# EasyEDA Pro project ProPrj_FireWheels_2025-05-12.epro, schematic Schematic2
Board Name: RC PAD; Create Date: 2025-05-06; Page Name: P1; Project Name: FireWheels; Schematic Name: Schematic2; Update Date: 2025-05-06; Company: EasyEDA.com; Page Size: A4; Version: V1.0
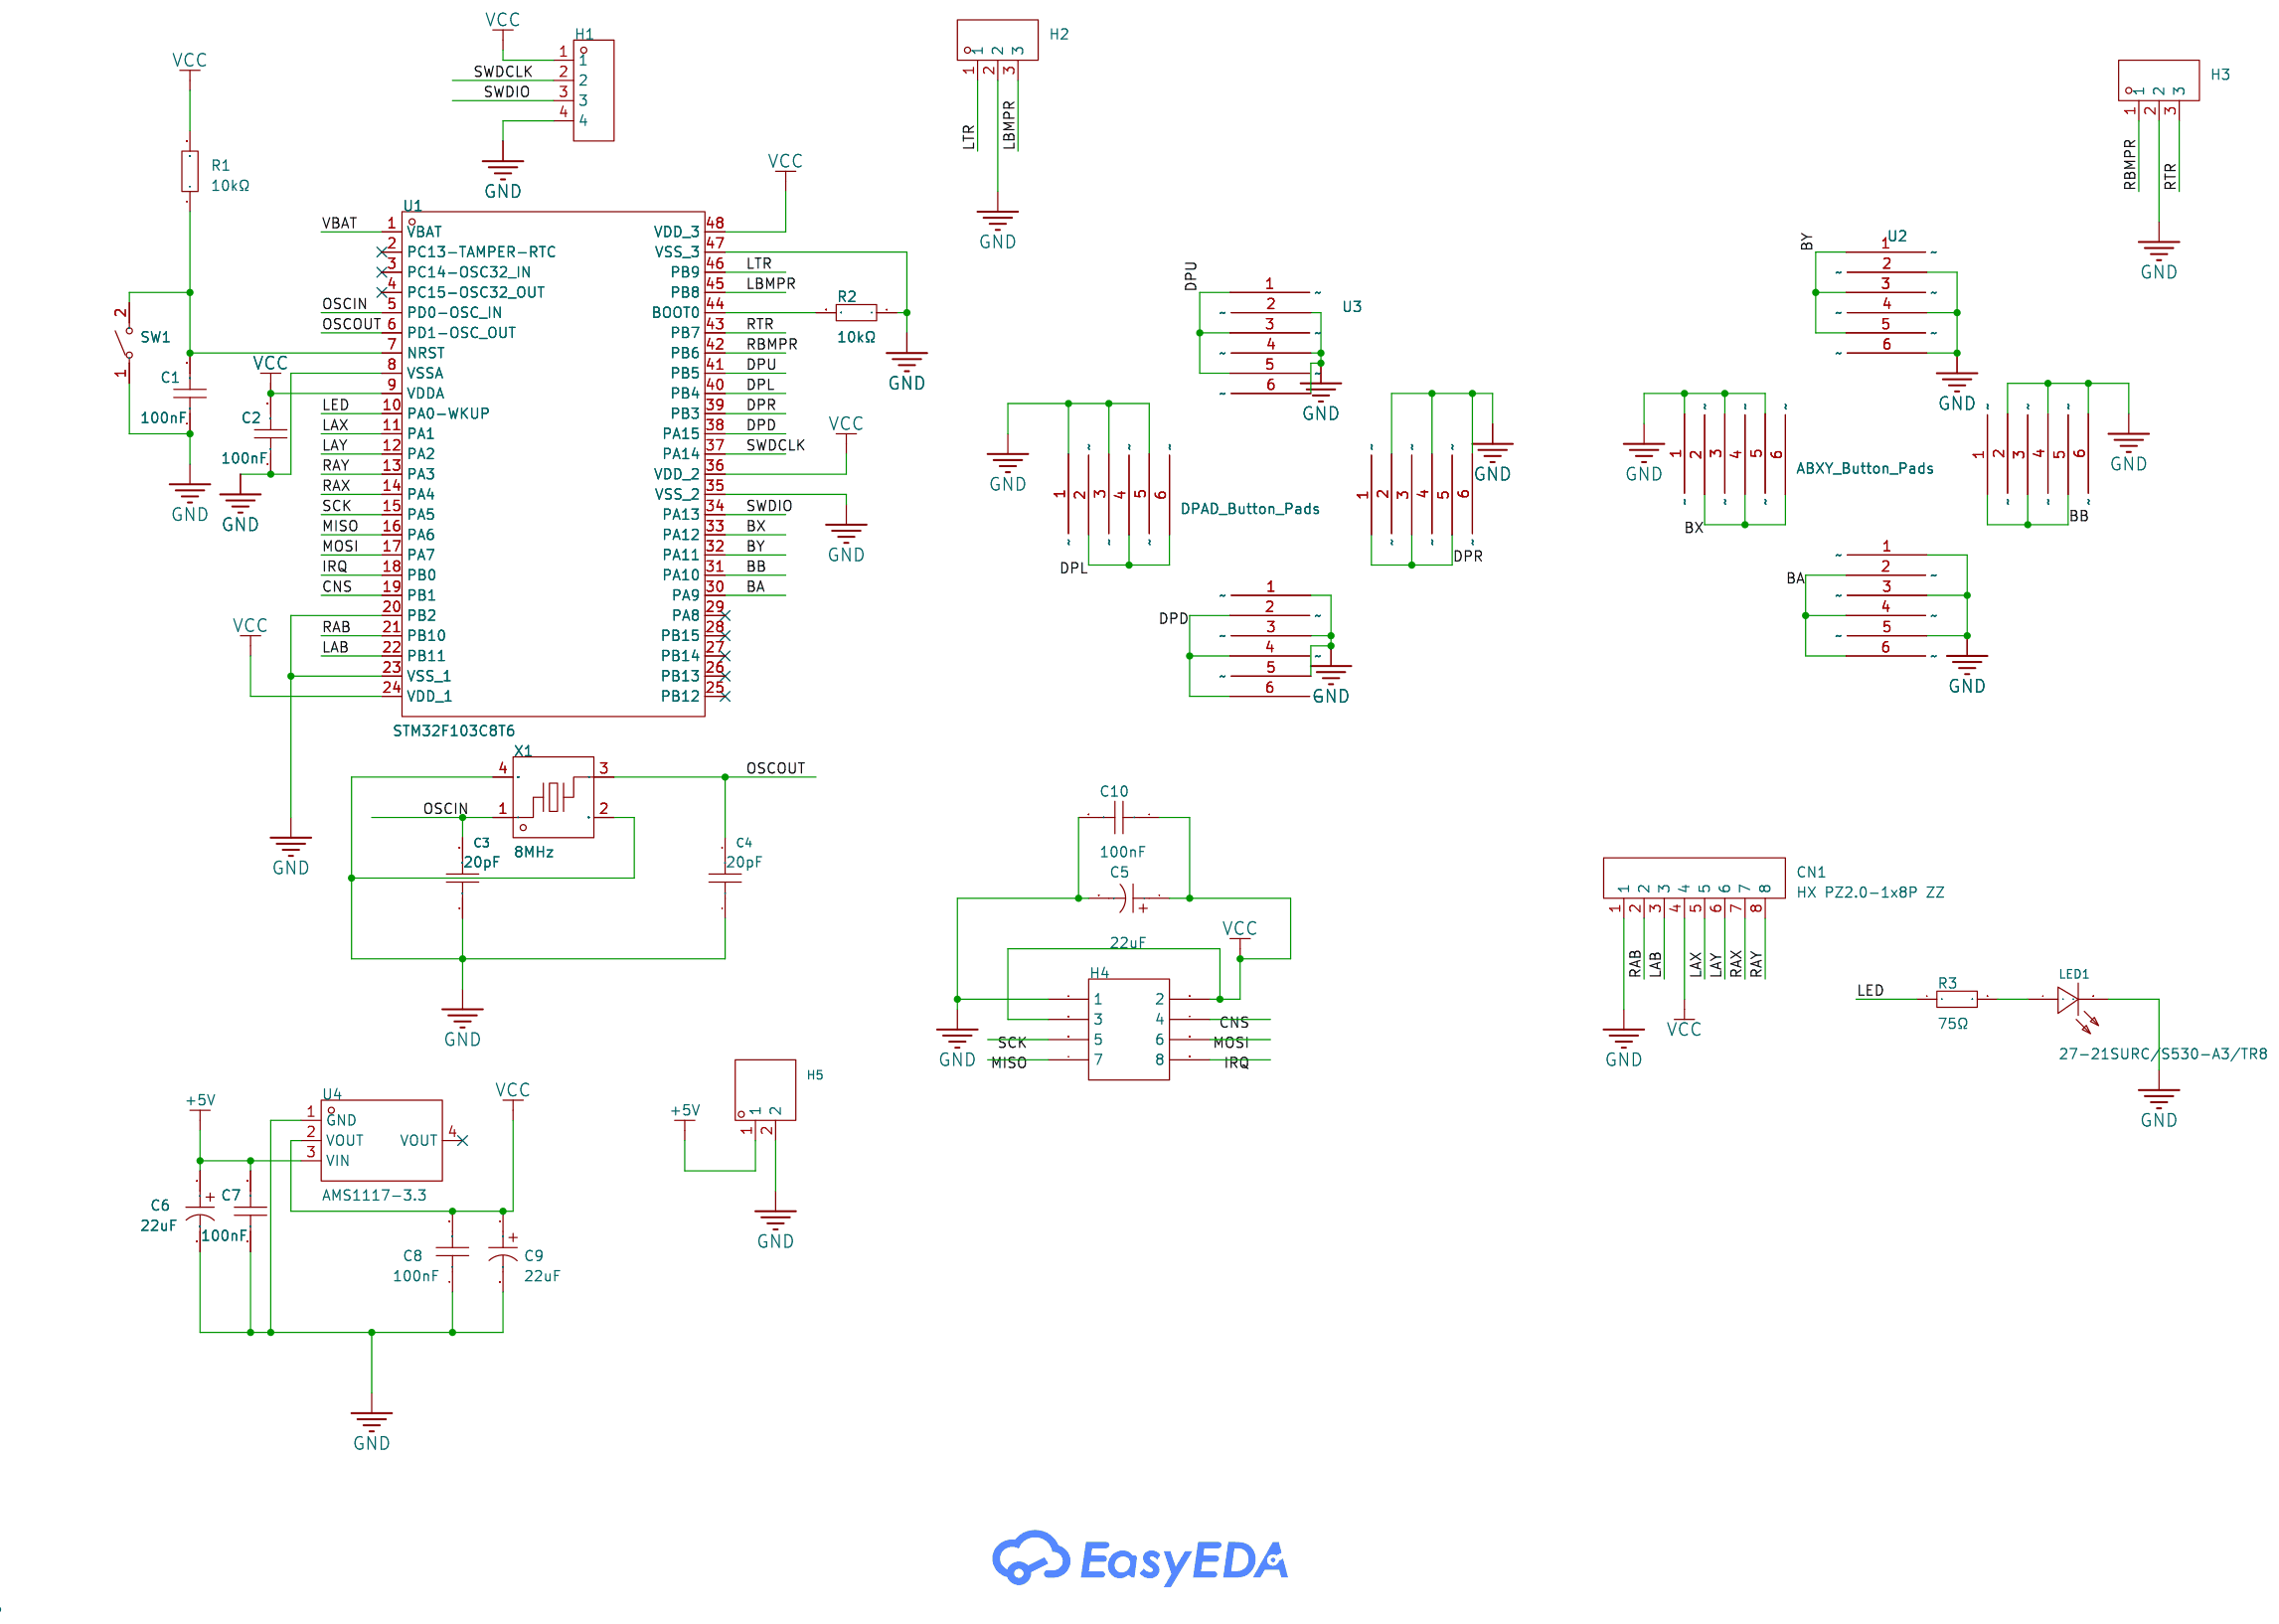
[diagram p2: schematic sheet]

## Parts
C1  100nF  [C0805]
C2  100nF  [C0805]
C3  20pF  [C0603]
C4  20pF  [C0603]
C5  22uF  [CAP-SMD_L3.5-W2.8-FD]
C6  22uF  [CAP-SMD_L3.5-W2.8-FD]
C7  100nF  [C0805]
C8  100nF  [C0805]
C9  22uF  [CAP-SMD_L3.5-W2.8-FD]
C10  100nF  [C0805]
CN1  HX PZ2.0-1x8P ZZ  [HDR-TH_8P-P2.00-V-M]
H1  -  [HDR-TH_4P-P2.54-V-M]
H2  -  [HDR-TH_3P-P2.54-V-M]
H3  -  [HDR-TH_3P-P2.54-V-M]
H4  -  [HDR-TH_8P-P2.54-V-F-R2-C4-S2.54-1]
H5  -  [HDR-TH_2P-P2.54-V-M-1]
LED1  27-21SURC/S530-A3/TR8  [LED-SMD_L1.7-W1.1-R-RD_RED]
R1  10kΩ  [R0603]
R2  10kΩ  [R0603]
R3  75Ω  [R1206]
SW1  -  [SW-SMD_L3.9-W3.0-P4.45]
U1  STM32F103C8T6  [LQFP-48_L7.0-W7.0-P0.50-LS9.0-BL]
U2  ABXY_Button_Pads  [ABXY_Button_Pads_MOD]
U3  DPAD_Button_Pads  [DPAD_Button_Pads_MOD]
U4  AMS1117-3.3  [SOT-223-3_L6.7-W3.7-P2.30-LS7.0-BR]
X1  8MHz  [CRYSTAL-SMD_4P-L3.2-W2.5-BL]

## Library data of the parts
C1 C2 C7 C8 C10 = 0805B104K250NT: Capacitance:100nF Tolerance:±10% Tolerance:±10% Voltage Rating: Temperature Coefficient:; LCSC Part Name: 100nF ±10% 25V; Supplier Part: C5120075; Manufacturer: FH(风华); Supplier Footprint: 0805; JLCPCB Part Class: Extended Part; Datasheet: https://atta.szlcsc.com/upload/public/pdf/source/20220722/AC92D000C7DDA6224FF67F7486E69D7A.pdf; Supplier: LCSC; Tolerance: ±10%
C3 C4 = TCC0603COG200J500CT: Capacitance: Tolerance:±5% Tolerance:±5% Voltage Rated: Temperature Coefficient:; LCSC Part Name: 20pF ±5% 50V; Supplier Part: C376774; Manufacturer: CCTC(三环); Supplier Footprint: 0603; JLCPCB Part Class: Extended Part; Datasheet: https://atta.szlcsc.com/upload/public/pdf/source/20191203/C466239_F62A586702D44EEA1C39B32FC8662B21.pdf; Supplier: LCSC; Tolerance: ±5%
C5 C6 C9 = T491B226K004AT: Capacitance: Tolerance:±10% Tolerance:±10% Voltage Rating: Current - Leakage:- Ripple Current:- Equivalent Series Resistance(ESR):3.5Ω Operating Temperature:-55℃~+125℃ Operating Temperature:-55℃~+125℃; LCSC Part Name: 22uF ±10% 4V; Supplier Part: C1953267; Manufacturer: KEMET(基美); Supplier Footprint: 1411; JLCPCB Part Class: Extended Part; Datasheet: https://atta.szlcsc.com/upload/public/pdf/source/20210416/95C0EC5B3581C9A90529545117ABEAC1.pdf; Supplier: LCSC; Tolerance: ±10%; Equivalent Series Resistance(ESR): 3.5Ω; Operating Temperature: -55℃~+125℃
CN1 = HX PZ2.0-1x8P ZZ: Pin Structure:1x8P Pitch:2mm Row Spacing:- Circluar Pins/Square Pins:Policy Mounting Type:Straight Number of Rows:Single Row Number of Pins:8P Current Rating:1.5A Voltage Rating (Max):- Length of Mating Pin:3.9mm Insulation Height:2mm Length of End Connec; LCSC Part Name: 1x8P 间距:2mm 方针 直插; Supplier Part: C22438291; Manufacturer: hanxia(韩下); Supplier Footprint: 插件,P=2mm; JLCPCB Part Class: Extended Part; Datasheet: https://atta.szlcsc.com/upload/public/pdf/source/20240522/C8C63A86F235927351453C32C5550B55.pdf; Supplier: LCSC; Pin Structure: 1x8P; Pitch: 2mm; Circluar Pins/Square Pins: Policy; Mounting Type: Straight; Number of Rows: Single Row; Number of Pins: 8P; Current Rating: 1.5A; Length of Mating Pin: 3.9mm; Insulation Height: 2mm; Length of End Connection Pin: 2.8mm; Contact Material: Phosphor Bronze; Contact Plating: Gold; Operating Temperature: -40℃~+105℃; Color: Black
H1 = HDR-M_2.54_1x4P: Supplier Footprint: Through
H2 H3 = HDR-M_2.54_1x3P: Supplier Footprint: Through
H4 = HDR-F-2.54_2x4: Supplier Footprint: Through
H5 = HDR-M_2.54_1x2P: Supplier Footprint: Through
LED1 = 27-21SURC/S530-A3/TR8: Emitted Color:Red Forward Voltage (VF):2V Forward Voltage (VF):2V Forward Current:20mA Dominant Wavelength:624nm Dominant Wavelength:624nm Peak Wavelength:632nm Lens Color:无色透明透镜 Luminous Intensity:57mcd Luminous Intensity:57mcd Viewing Angle:130°; LCSC Part Name: 红灯; Supplier Part: C131210; Manufacturer: EVERLIGHT(亿光); Supplier Footprint: SMD,1.1x1.7mm; JLCPCB Part Class: Extended Part; Datasheet: https://atta.szlcsc.com/upload/public/pdf/source/20170918/C131210_1505726868415976222.pdf; Supplier: LCSC; Emitted Color: Red; Forward Voltage (VF): 2V; Forward Current: 20mA; Dominant Wavelength: 624nm; Peak Wavelength: 632nm; Lens Color: 无色透明透镜; Luminous Intensity: 57mcd; Viewing Angle: 130°
R1 R2 = RC0603FR-0710KL: Type:Thick Film Resistors Resistance: Tolerance:±1% Tolerance:±1% Power(Watts): Overload Voltage (Max): Temperature Coefficient:±100ppm/℃ Temperature Coefficient:±100ppm/℃ Operating Temperature Range:-55℃~+155℃ Operating Temperature Range:-55℃~+155℃; LCSC Part Name: 厚膜电阻 10kΩ ±1% 100mW; Supplier Part: C98220; Manufacturer: YAGEO(国巨); Supplier Footprint: 0603; JLCPCB Part Class: Extended Part; Datasheet: https://atta.szlcsc.com/upload/public/pdf/source/20180927/C295883_E8D83085EA81BD7DE0B2B681138C15EE.pdf; Supplier: LCSC; Type: Thick Film Resistors; Tolerance: ±1%; Temperature Coefficient: ±100ppm/℃; Operating Temperature Range: -55℃~+155℃
R3 = RC1206FR-0775RL: Type:Thick Film Resistors Resistance: Tolerance:±1% Tolerance:±1% Power(Watts):250mW Overload Voltage (Max): Temperature Coefficient:±100ppm/℃ Temperature Coefficient:±100ppm/℃ Operating Temperature Range:-55℃~+155℃ Operating Temperature Range:-55℃~+155℃; LCSC Part Name: 厚膜电阻 75Ω ±1% 250mW; Supplier Part: C137233; Manufacturer: YAGEO(国巨); Supplier Footprint: 1206; JLCPCB Part Class: Extended Part; Datasheet: https://atta.szlcsc.com/upload/public/pdf/source/20180224/C181757_15194369480721363983.pdf; Supplier: LCSC; Type: Thick Film Resistors; Tolerance: ±1%; Power(Watts): 250mW; Temperature Coefficient: ±100ppm/℃; Operating Temperature Range: -55℃~+155℃
SW1 = TS-1088R-02026: Contact Current:50mA Voltage Rating (DC):12V Circuit:SPST Mounting Style:Brick nogging Actuator Style:Round Button With Lamp:- Switch Length:3.9mm Switch Width:2.93mm Switch Height:2mm; LCSC Part Name: 贴片无柱小龟轻触开关 260GF; Supplier Part: C455280; Manufacturer: XUNPU(讯普); Supplier Footprint: SMD,3x4x2mm; JLCPCB Part Class: Extended Part; Datasheet: https://atta.szlcsc.com/upload/public/pdf/source/20191118/C455280_718CC4284DAF75EEB0AC8229AE7E40C5.pdf; Supplier: LCSC; Contact Current: 50mA; Voltage Rating (DC): 12V; Circuit: SPST; Mounting Style: Brick nogging; Actuator Style: Round Button; Switch Length: 3.9mm; Switch Width: 2.93mm; Switch Height: 2mm
U1 = STM32F103C8T6: CPU Core:ARM-M3 CPU Maximum Speed:72MHz Program Storage Size:64KB Program Memory Type:FLASH Number of I/O:37 ADC (Bit):12bit Low Voltage Detection Threshold:2V~3.6V Low Voltage Detection Threshold:2V~3.6V Application Area:-; LCSC Part Name: 主流增强型ARM Cortex-M3 MCU，具有64 KB Flash、72 MHz CPU、电机控制、USB和CAN; Supplier Part: C8734; Manufacturer: ST(意法半导体); Supplier Footprint: LQFP-48(7x7); JLCPCB Part Class: Extended Part; Datasheet: https://atta.szlcsc.com/upload/public/pdf/source/20220812/8363ACEC51AD55ECEB84799464F7CB85.pdf; Supplier: LCSC; CPU Core: ARM-M3; CPU Maximum Speed: 72MHz; Program Storage Size: 64KB; Program Memory Type: FLASH; Number of I/O: 37; ADC (Bit): 12bit; Low Voltage Detection Threshold: 2V~3.6V
U2 U3 = ABXY_Button_Pads
U4 = AMS1117-3.3_C917183: Output Type:Fixed Maximum Input Voltage:- Output Voltage:3.3V Output Voltage:3.3V Output Current:1A Power Supply Rejection Ratio (PSRR):72dB@120Hz Dropout Voltage:1.3V@(1A) standby current:- Noise:- Feature:Thermal Protection(TSD) Operating Temperature:-; LCSC Part Name: 正 Vin=15V Vout=3.3V 1A; Supplier Part: C917183; Manufacturer: JSMSEMI(杰盛微); Supplier Footprint: SOT-223-3; JLCPCB Part Class: Extended Part; Datasheet: https://atta.szlcsc.com/upload/public/pdf/source/20241031/020B33F96DEC818342B616F1580B891C.pdf; Supplier: LCSC; Output Type: Fixed; Output Voltage: 3.3V; Output Current: 1A; Power Supply Rejection Ratio (PSRR): 72dB@120Hz; Dropout Voltage: 1.3V@(1A); Feature: Thermal Protection(TSD)
X1 = 3TJ480000NWLAC: Type:Surface Mount Crystal Frequency:8MHz Normal temperature Frequency Tolerance:±20ppm Normal temperature Frequency Tolerance:±20ppm Load Capacitance:; LCSC Part Name: 8MHz ±20ppm 12pF; Supplier Part: C3031829; Manufacturer: JYJE(晶友嘉); Supplier Footprint: SMD3225-4P; JLCPCB Part Class: Extended Part; Datasheet: https://atta.szlcsc.com/upload/public/pdf/source/20210114/C2149013_C841380407E0329693B4ECED06382C6A.pdf; Supplier: LCSC; Type: Surface Mount Crystal; Normal temperature Frequency Tolerance: ±20ppm

## Nets
+5V: C6.1 C7.2 H5.1 U4.3(VIN)
GND: C1.1 C2.1 C3.1 C4.1 C5.2 C6.2 C7.1 C8.1 C9.2 C10.2 CN1.1 H1.4 H2.2 H3.2 H4.1 H5.2 LED1.2(K) R2.1 SW1.1 U1.8(VSSA) U1.20(PB2) U1.23(VSS_1) U1.30(PA9) U1.31(PA10) U1.32(PA11) U1.33(PA12) U1.35(VSS_2) U1.38(PA15) U1.39(PB3) U1.40(PB4) U1.41(PB5) U1.47(VSS_3) U2.1 U2.2 U2.3 U2.4 U2.5 U2.6 U3.1 U3.2 U3.3 U3.4 U3.5 U3.6 U4.1(GND) X1.2(GND) X1.4(GND)
VBAT: U1.1(VBAT)
VCC: C2.2 C5.1 C8.2 C9.1 C10.1 CN1.4 H1.1 H4.2 H4.3 R1.2 U1.9(VDDA) U1.24(VDD_1) U1.36(VDD_2) U1.48(VDD_3) U4.2(VOUT)
CNS: H4.4 U1.19(PB1)
IRQ: H4.8 U1.18(PB0)
LAB: CN1.3 U1.22(PB11)
LAX: CN1.5 U1.11(PA1)
LAY: CN1.6 U1.12(PA2)
LBMPR: H2.3 U1.45(PB8)
LED: R3.1 U1.10(PA0-WKUP)
LTR: H2.1 U1.46(PB9)
MISO: H4.7 U1.16(PA6)
MOSI: H4.6 U1.17(PA7)
OSCIN: C3.2 U1.5(PD0-OSC_IN) X1.1
OSCOUT: C4.2 U1.6(PD1-OSC_OUT) X1.3
RAB: CN1.2 U1.21(PB10)
RAX: CN1.7 U1.14(PA4)
RAY: CN1.8 U1.13(PA3)
RBMPR: H3.1 U1.42(PB6)
RTR: H3.3 U1.43(PB7)
SCK: H4.5 U1.15(PA5)
SWDCLK: H1.2 U1.37(PA14)
SWDIO: H1.3 U1.34(PA13)
$1N975: R2.2 U1.44(BOOT0)
$1N1012: C1.2 R1.1 SW1.2 U1.7(NRST)
$1N3442: LED1.1(A) R3.2

Not connected (* = marked no-connect by the designer): U1 2(PC13-TAMPER-RTC)* 3(PC14-OSC32_IN)* 4(PC15-OSC32_OUT)* 25(PB12)* 26(PB13)* 27(PB14)* 28(PB15)* 29(PA8)*; U4 4(VOUT)*
